# EAGLE schematic expandio (EAGLE 5.07)
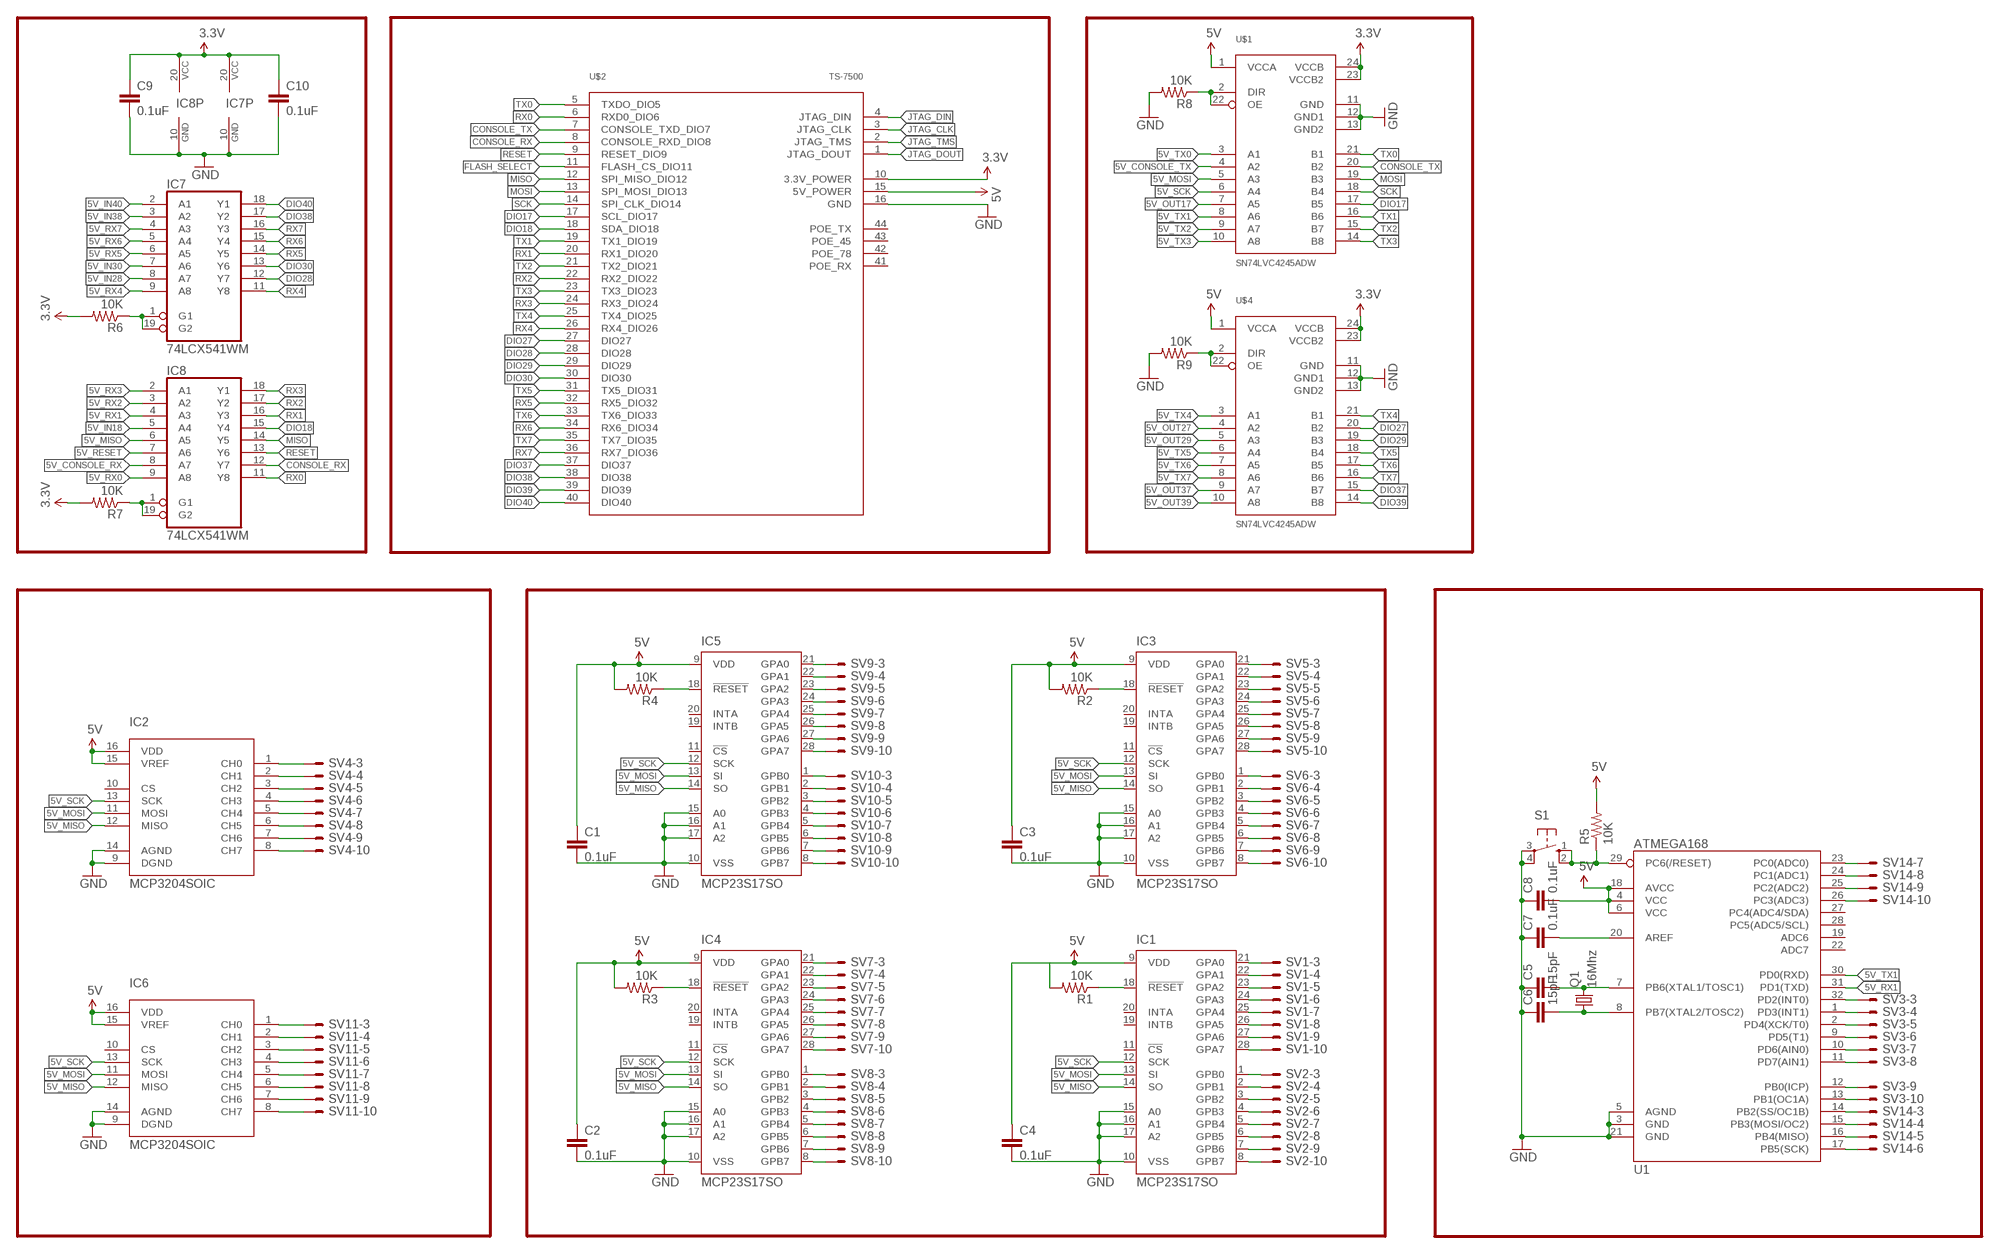
[diagram p0: schematic, sheet 1, part 1 of 2]
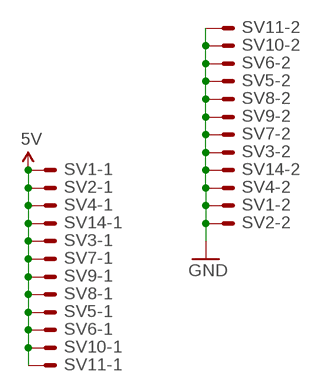
[diagram p1: schematic, sheet 1, part 2 of 2]

## Parts
C1  0.1uF  CAP0805  [0805]
C2  0.1uF  CAP0805  [0805]
C3  0.1uF  CAP0805  [0805]
C4  0.1uF  CAP0805  [0805]
C5  15pF  CAP0805  [0805]
C6  15pF  CAP0805  [0805]
C7  0.1uF  CAP0805  [0805]
C8  0.1uF  CAP0805  [0805]
C9  0.1uF  CAP0805  [0805]
C10  0.1uF  CAP0805  [0805]
IC1  MCP23S17SO  [SO28W]
IC2  MCP3204SOIC  [SO16]
IC3  MCP23S17SO  [SO28W]
IC4  MCP23S17SO  [SO28W]
IC5  MCP23S17SO  [SO28W]
IC6  MCP3204SOIC  [SO16]
IC7  74LCX541WM  74LS541DW  [SO20W]
IC8  74LCX541WM  74LS541DW  [SO20W]
Q1  16Mhz  CRYSTALHC49UV  [HC49U-V]
R1  10K  RESISTOR  [0805]
R2  10K  RESISTOR  [0805]
R3  10K  RESISTOR  [0805]
R4  10K  RESISTOR  [0805]
R5  10K  RESISTOR  [0805]
R6  10K  RESISTOR  [0805]
R7  10K  RESISTOR  [0805]
R8  10K  RESISTOR  [0805]
R9  10K  RESISTOR  [0805]
S1  10-XX  [B3F-10XX]
SV1  ML10E  [ML10]
SV2  ML10E  [ML10]
SV3  ML10E  [ML10]
SV4  ML10E  [ML10]
SV5  ML10E  [ML10]
SV6  ML10E  [ML10]
SV7  ML10E  [ML10]
SV8  ML10E  [ML10]
SV9  ML10E  [ML10]
SV10  ML10E  [ML10]
SV11  ML10E  [ML10]
SV14  ML10E  [ML10]
U1  ATMEGA168  [TQFP32-08]
U$1  SN74LVC4245ADW  [SO24W]
U$2  TS-7500  [TS-7500]
U$4  SN74LVC4245ADW  [SO24W]

## Nets
3.3V: C9.1 C10.1 IC7.20(VCC) IC8.20(VCC) R6.2 R7.2 U$1.23(VCCB2) U$1.24(VCCB) U$2.10(3.3V_POWER) U$4.23(VCCB2) U$4.24(VCCB)
5V: C1.1 C2.1 C3.1 C4.1 C8.2 IC1.9(VDD) IC2.15(VREF) IC2.16(VDD) IC3.9(VDD) IC4.9(VDD) IC5.9(VDD) IC6.15(VREF) IC6.16(VDD) R1.2 R2.2 R3.2 R4.2 R5.2 SV1.1 SV2.1 SV3.1 SV4.1 SV5.1 SV6.1 SV7.1 SV8.1 SV9.1 SV10.1 SV11.1 SV14.1 U1.4(VCC) U1.6(VCC) U1.18(AVCC) U$1.1(VCCA) U$2.15(5V_POWER) U$4.1(VCCA)
5V_CONSOLE_RX: IC8.8(A7)
5V_CONSOLE_TX: U$1.4(A2)
5V_IN18: IC8.5(A4)
5V_IN28: IC7.8(A7)
5V_IN30: IC7.7(A6)
5V_IN38: IC7.3(A2)
5V_IN40: IC7.2(A1)
5V_MISO: IC1.14(SO) IC2.12(MISO) IC3.14(SO) IC4.14(SO) IC5.14(SO) IC6.12(MISO) IC8.6(A5)
5V_MOSI: IC1.13(SI) IC2.11(MOSI) IC3.13(SI) IC4.13(SI) IC5.13(SI) IC6.11(MOSI) U$1.5(A3)
5V_OUT17: U$1.7(A5)
5V_OUT27: U$4.4(A2)
5V_OUT29: U$4.5(A3)
5V_OUT37: U$4.9(A7)
5V_OUT39: U$4.10(A8)
5V_RESET: IC8.7(A6)
5V_RX0: IC8.9(A8)
5V_RX1: IC8.4(A3) U1.31(PD1(TXD))
5V_RX2: IC8.3(A2)
5V_RX3: IC8.2(A1)
5V_RX4: IC7.9(A8)
5V_RX5: IC7.6(A5)
5V_RX6: IC7.5(A4)
5V_RX7: IC7.4(A3)
5V_SCK: IC1.12(SCK) IC2.13(SCK) IC3.12(SCK) IC4.12(SCK) IC5.12(SCK) IC6.13(SCK) U$1.6(A4)
5V_TX0: U$1.3(A1)
5V_TX1: U1.30(PD0(RXD)) U$1.8(A6)
5V_TX2: U$1.9(A7)
5V_TX3: U$1.10(A8)
5V_TX4: U$4.3(A1)
5V_TX5: U$4.6(A4)
5V_TX6: U$4.7(A5)
5V_TX7: U$4.8(A6)
CONSOLE_RX: IC8.12(Y7) U$2.8(CONSOLE_RXD_DIO8)
CONSOLE_TX: U$1.20(B2) U$2.7(CONSOLE_TXD_DIO7)
DIO17: U$1.17(B5) U$2.17(SCL_DIO17)
DIO18: IC8.15(Y4) U$2.18(SDA_DIO18)
DIO27: U$2.27(DIO27) U$4.20(B2)
DIO28: IC7.12(Y7) U$2.28(DIO28)
DIO29: U$2.29(DIO29) U$4.19(B3)
DIO30: IC7.13(Y6) U$2.30(DIO30)
DIO37: U$2.37(DIO37) U$4.15(B7)
DIO38: IC7.17(Y2) U$2.38(DIO38)
DIO39: U$2.39(DIO39) U$4.14(B8)
DIO40: IC7.18(Y1) U$2.40(DIO40)
FLASH_SELECT: U$2.11(FLASH_CS_DIO11)
GND: C1.2 C2.2 C3.2 C4.2 C5.1 C6.1 C7.1 C8.1 C9.2 C10.2 IC1.10(VSS) IC1.15(A0) IC1.16(A1) IC1.17(A2) IC2.9(DGND) IC2.14(AGND) IC3.10(VSS) IC3.15(A0) IC3.16(A1) IC3.17(A2) IC4.10(VSS) IC4.15(A0) IC4.16(A1) IC4.17(A2) IC5.10(VSS) IC5.15(A0) IC5.16(A1) IC5.17(A2) IC6.9(DGND) IC6.14(AGND) IC7.10(GND) IC8.10(GND) R8.2 R9.2 S1.3(P) S1.4(P1) SV1.2 SV2.2 SV3.2 SV4.2 SV5.2 SV6.2 SV7.2 SV8.2 SV9.2 SV10.2 SV11.2 SV14.2 U1.3(GND) U1.5(AGND) U1.21(GND) U$1.11(GND) U$1.12(GND1) U$1.13(GND2) U$2.16(GND) U$4.11(GND) U$4.12(GND1) U$4.13(GND2)
GPA0: IC1.21(GPA0) SV1.3
GPA1: IC1.22(GPA1) SV1.4
GPA2: IC1.23(GPA2) SV1.5
GPA3: IC3.21(GPA0) SV5.3
GPA4: IC3.22(GPA1) SV5.4
GPA5: IC3.23(GPA2) SV5.5
GPA6: IC4.21(GPA0) SV7.3
GPA7: IC4.22(GPA1) SV7.4
GPA8: IC4.23(GPA2) SV7.5
GPA9: IC5.21(GPA0) SV9.3
GPA10: IC5.22(GPA1) SV9.4
GPA11: IC5.23(GPA2) SV9.5
JTAG_CLK: U$2.3(JTAG_CLK)
JTAG_DIN: U$2.4(JTAG_DIN)
JTAG_DOUT: U$2.1(JTAG_DOUT)
JTAG_TMS: U$2.2(JTAG_TMS)
MISO: IC8.14(Y5) U$2.12(SPI_MISO_DIO12)
MOSI: U$1.19(B3) U$2.13(SPI_MOSI_DIO13)
N$1: IC1.24(GPA3) SV1.6
N$2: IC1.25(GPA4) SV1.7
N$3: IC1.26(GPA5) SV1.8
N$4: IC1.27(GPA6) SV1.9
N$5: IC1.18(!RESET) R1.1
N$6: IC1.28(GPA7) SV1.10
N$7: IC1.1(GPB0) SV2.3
N$8: IC1.2(GPB1) SV2.4
N$9: IC1.3(GPB2) SV2.5
N$10: IC1.4(GPB3) SV2.6
N$11: IC1.5(GPB4) SV2.7
N$12: IC1.6(GPB5) SV2.8
N$13: IC1.7(GPB6) SV2.9
N$14: IC1.8(GPB7) SV2.10
N$15: IC2.1(CH0) SV4.3
N$16: IC2.2(CH1) SV4.4
N$17: IC2.3(CH2) SV4.5
N$18: IC2.4(CH3) SV4.6
N$19: IC2.5(CH4) SV4.7
N$20: IC2.6(CH5) SV4.8
N$21: IC2.7(CH6) SV4.9
N$22: IC2.8(CH7) SV4.10
N$23: IC3.18(!RESET) R2.1
N$24: IC3.24(GPA3) SV5.6
N$25: IC3.25(GPA4) SV5.7
N$26: IC3.26(GPA5) SV5.8
N$27: IC3.27(GPA6) SV5.9
N$28: IC3.28(GPA7) SV5.10
N$29: IC3.1(GPB0) SV6.3
N$30: IC3.2(GPB1) SV6.4
N$31: IC3.3(GPB2) SV6.5
N$32: IC3.4(GPB3) SV6.6
N$33: IC3.5(GPB4) SV6.7
N$34: IC3.6(GPB5) SV6.8
N$35: IC3.7(GPB6) SV6.9
N$36: IC3.8(GPB7) SV6.10
N$37: IC4.18(!RESET) R3.1
N$38: IC4.24(GPA3) SV7.6
N$39: IC4.25(GPA4) SV7.7
N$40: IC4.26(GPA5) SV7.8
N$41: IC4.27(GPA6) SV7.9
N$42: IC4.28(GPA7) SV7.10
N$43: IC4.1(GPB0) SV8.3
N$44: IC4.2(GPB1) SV8.4
N$45: IC4.3(GPB2) SV8.5
N$46: IC4.4(GPB3) SV8.6
N$47: IC4.5(GPB4) SV8.7
N$48: IC4.6(GPB5) SV8.8
N$49: IC4.7(GPB6) SV8.9
N$50: IC4.8(GPB7) SV8.10
N$51: IC5.18(!RESET) R4.1
N$52: IC5.24(GPA3) SV9.6
N$53: IC5.25(GPA4) SV9.7
N$54: IC5.26(GPA5) SV9.8
N$55: IC5.27(GPA6) SV9.9
N$56: IC5.28(GPA7) SV9.10
N$57: IC5.1(GPB0) SV10.3
N$58: IC5.2(GPB1) SV10.4
N$59: IC5.3(GPB2) SV10.5
N$60: IC5.4(GPB3) SV10.6
N$61: IC5.5(GPB4) SV10.7
N$62: IC5.6(GPB5) SV10.8
N$63: IC5.7(GPB6) SV10.9
N$64: IC5.8(GPB7) SV10.10
N$65: IC6.1(CH0) SV11.3
N$66: IC6.2(CH1) SV11.4
N$67: IC6.3(CH2) SV11.5
N$68: IC6.4(CH3) SV11.6
N$69: IC6.5(CH4) SV11.7
N$70: IC6.6(CH5) SV11.8
N$71: IC6.7(CH6) SV11.9
N$72: IC6.8(CH7) SV11.10
N$73: R5.1 S1.1(S) S1.2(S1) U1.29(PC6(/RESET))
N$74: C7.2 U1.20(AREF)
N$75: C5.2 Q1.2 U1.7(PB6(XTAL1/TOSC1))
N$76: C6.2 Q1.1 U1.8(PB7(XTAL2/TOSC2))
N$77: SV14.7 U1.23(PC0(ADC0))
N$78: SV14.8 U1.24(PC1(ADC1))
N$79: SV14.9 U1.25(PC2(ADC2))
N$80: SV14.10 U1.26(PC3(ADC3))
N$81: SV3.3 U1.32(PD2(INT0))
N$82: SV3.4 U1.1(PD3(INT1))
N$83: SV3.5 U1.2(PD4(XCK/T0))
N$84: SV3.6 U1.9(PD5(T1))
N$85: SV3.7 U1.10(PD6(AIN0))
N$86: SV3.8 U1.11(PD7(AIN1))
N$87: SV3.9 U1.12(PB0(ICP))
N$88: SV3.10 U1.13(PB1(OC1A))
N$89: SV14.3 U1.14(PB2(SS/OC1B))
N$90: SV14.4 U1.15(PB3(MOSI/OC2))
N$91: SV14.5 U1.16(PB4(MISO))
N$92: SV14.6 U1.17(PB5(SCK))
N$93: R8.1 U$1.2(DIR) U$1.22(OE)
N$94: R9.1 U$4.2(DIR) U$4.22(OE)
N$95: IC8.1(G1) IC8.19(G2) R7.1
N$96: IC7.1(G1) IC7.19(G2) R6.1
RESET: IC8.13(Y6) U$2.9(RESET_DIO9)
RX0: IC8.11(Y8) U$2.6(RXD0_DIO6)
RX1: IC8.16(Y3) U$2.20(RX1_DIO20)
RX2: IC8.17(Y2) U$2.22(RX2_DIO22)
RX3: IC8.18(Y1) U$2.24(RX3_DIO24)
RX4: IC7.11(Y8) U$2.26(RX4_DIO26)
RX5: IC7.14(Y5) U$2.32(RX5_DIO32)
RX6: IC7.15(Y4) U$2.34(RX6_DIO34)
RX7: IC7.16(Y3) U$2.36(RX7_DIO36)
SCK: U$1.18(B4) U$2.14(SPI_CLK_DIO14)
TX0: U$1.21(B1) U$2.5(TXDO_DIO5)
TX1: U$1.16(B6) U$2.19(TX1_DIO19)
TX2: U$1.15(B7) U$2.21(TX2_DIO21)
TX3: U$1.14(B8) U$2.23(TX3_DIO23)
TX4: U$2.25(TX4_DIO25) U$4.21(B1)
TX5: U$2.31(TX5_DIO31) U$4.18(B4)
TX6: U$2.33(TX6_DIO33) U$4.17(B5)
TX7: U$2.35(TX7_DIO35) U$4.16(B6)
Unconnected: IC1.11(!CS) IC1.19(INTB) IC1.20(INTA) IC2.10(CS) IC3.11(!CS) IC3.19(INTB) IC3.20(INTA) IC4.11(!CS) IC4.19(INTB) IC4.20(INTA) IC5.11(!CS) IC5.19(INTB) IC5.20(INTA) IC6.10(CS) U1.19(ADC6) U1.22(ADC7) U1.27(PC4(ADC4/SDA)) U1.28(PC5(ADC5/SCL)) U$2.41(POE_RX) U$2.42(POE_78) U$2.43(POE_45) U$2.44(POE_TX)

## Library data of the parts
C1-C10 = SparkFun:CAP: Capacitor Standard 0603 ceramic capacitor, and 0.1" leaded capacitor.
IC1 IC3-IC5 = microchip:MCP23S17: http://ww1.microchip.com/downloads/en/DeviceDoc/21952a.pdf Source: http://ww1.microchip.com/downloads/en/DeviceDoc/21952a.pdf
IC2 IC6 = reprap:MCP3204
IC7 IC8 = 74xx-us:74*541: Octal BUFFER and LINE DRIVER, 3-state
Q1 = SparkFun:CRYSTAL: Crystals Various standard crystals. Proven footprints. Spark Fun Electronics SKU : COM-00534
R1-R9 = SparkFun:RESISTOR: Resistor Basic schematic elements and footprints for 0603, 1206, and PTH 1/10th watt (small) resistors.
S1 = switch-omron:10-XX: OMRON SWITCH
SV1-SV11 SV14 = con-harting-ml:ML10?E: HARTING
U1 = SparkFun:ATMEGA168
U$1 U$4 = MakerBot:SN74LVC4245A
U$2 = MakerBot:TS-7500